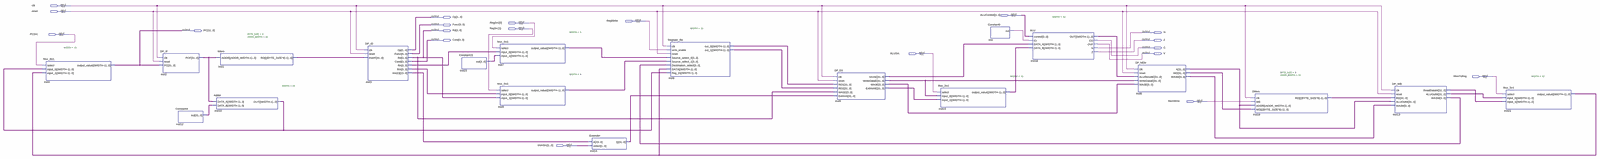
[diagram p0: schematic sheet, whole]
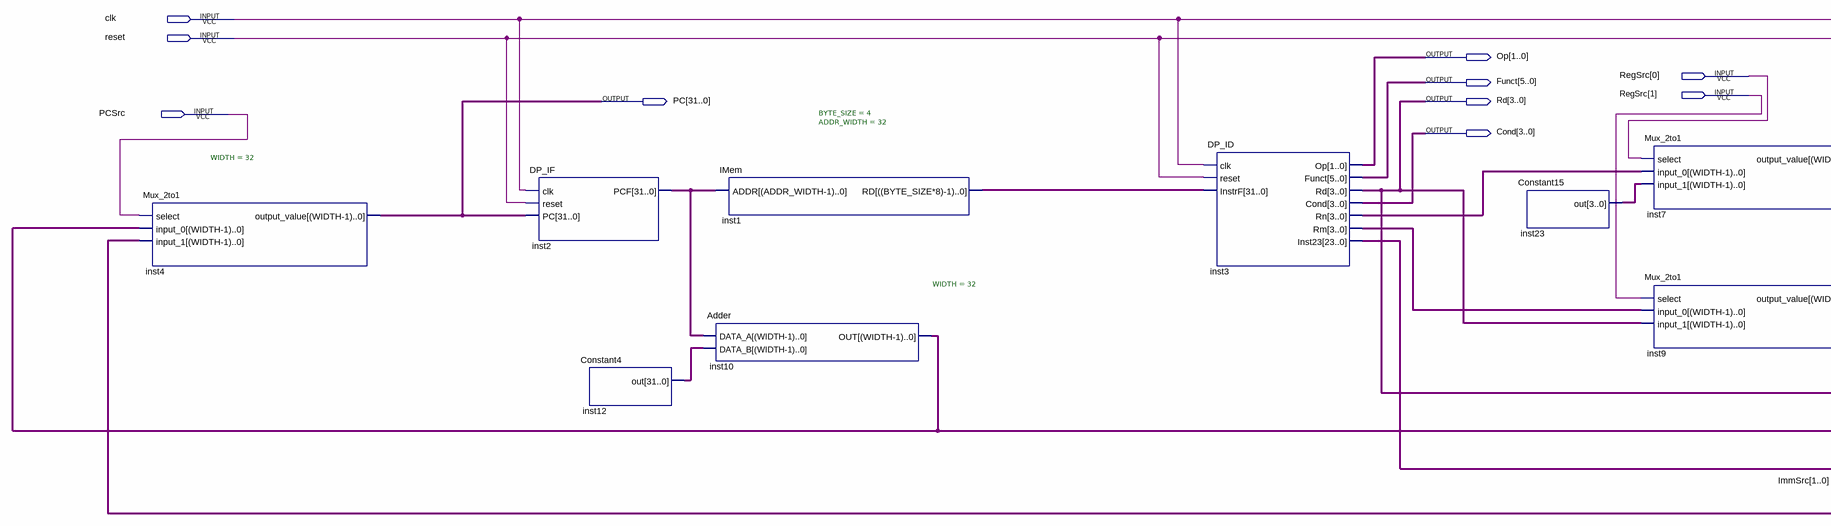
[diagram p1: schematic sheet, left part]
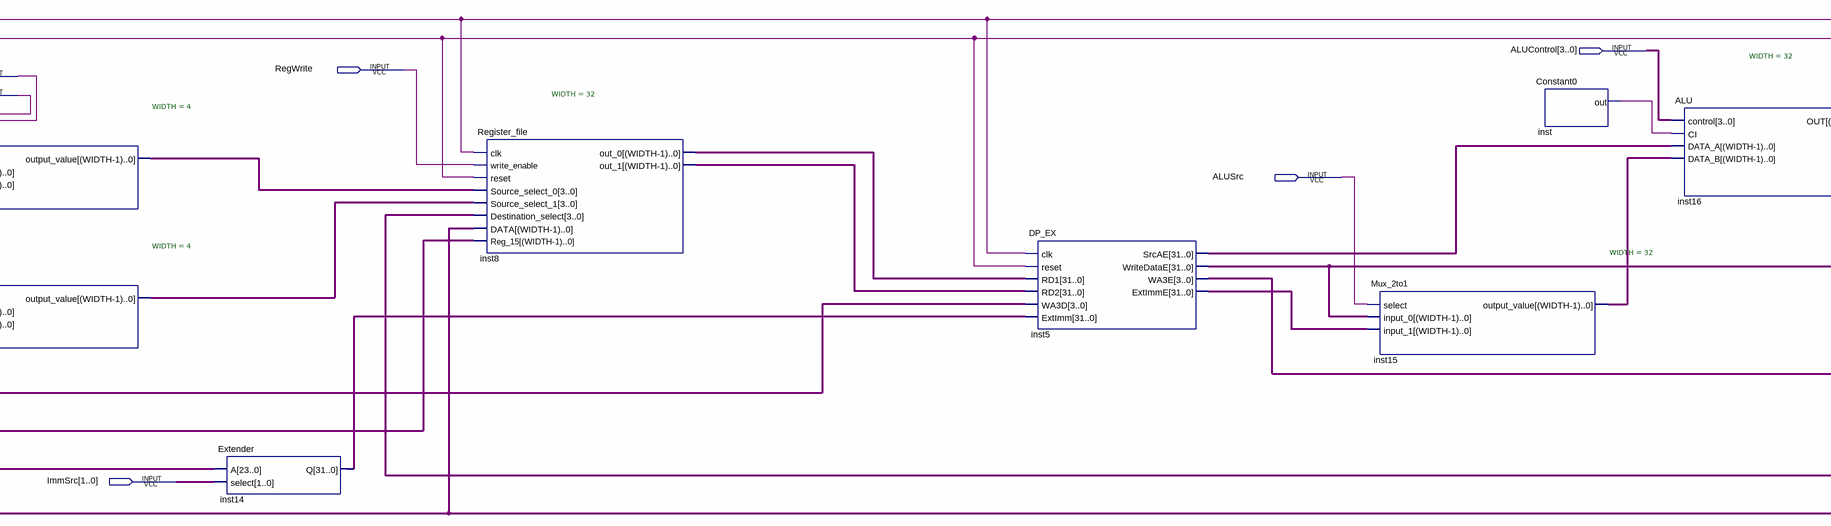
[diagram p2: schematic sheet, centre part]
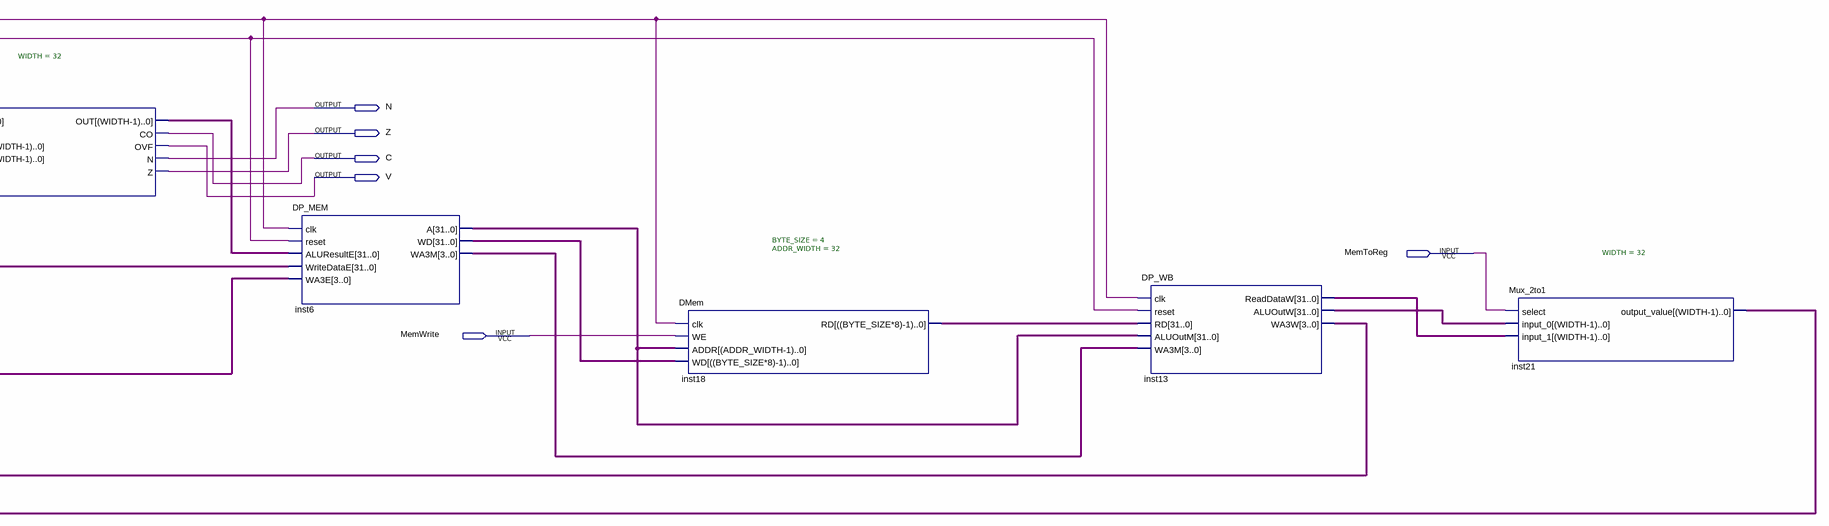
[diagram p3: schematic sheet, right part]
// Quartus schematic Datapath.bdf as structural Verilog: 19 symbols, 20 pins
module Datapath (
  input  clk,
  input  reset,
  input  [3:0] ALUControl,
  input  RegWrite,
  input  [1:0] RegSrc,
  input  PCSrc,
  input  ALUSrc,
  input  MemToReg,
  input  MemWrite,
  input  [1:0] ImmSrc,
  output [1:0] Op,
  output [5:0] Funct,
  output [31:0] PC,
  output [3:0] Rd,
  output N,
  output [3:0] Cond,
  output Z,
  output C,
  output V
);

  wire inst_out;
  wire [3:0] inst3_rm, inst3_rn, inst5_wa3e, inst6_wa3m, inst7_output_value, inst9_output_value, inst13_wa3w,
       inst23_out;
  wire [23:0] inst3_inst23;
  wire [31:0] inst1_rd, inst2_pcf, inst5_extimme, inst5_srcae, inst5_writedatae, inst6_a, inst6_wd,
       inst8_out_0, inst8_out_1, inst10_out, inst12_out, inst13_aluoutw, inst13_readdataw, inst14_q,
       inst15_output_value, inst16_out, inst18_rd, inst21_output_value;

  Mux_2to1 #(.WIDTH(32)) inst4 (.select(PCSrc), .input_0(inst10_out), .input_1(inst21_output_value), .output_value(PC));
  DP_IF inst2 (.clk(clk), .reset(reset), .PC(PC), .PCF(inst2_pcf));
  Constant4 inst12 (.out(inst12_out));
  IMem #(.BYTE_SIZE(4), .ADDR_WIDTH(32)) inst1 (.ADDR(inst2_pcf), .RD(inst1_rd));
  Adder #(.WIDTH(32)) inst10 (.DATA_A(inst2_pcf), .DATA_B(inst12_out), .OUT(inst10_out));
  DP_ID inst3 (
    .clk(clk), .reset(reset), .InstrF(inst1_rd), .Op(Op), .Funct(Funct), .Rd(Rd), .Cond(Cond), .Rn(inst3_rn),
    .Rm(inst3_rm), .Inst23(inst3_inst23));
  Constant15 inst23 (.out(inst23_out));
  Mux_2to1 #(.WIDTH(4)) inst7 (
    .select(RegSrc[0]), .input_0(inst3_rn), .input_1(inst23_out), .output_value(inst7_output_value));
  Mux_2to1 #(.WIDTH(4)) inst9 (.select(RegSrc[1]), .input_0(inst3_rm), .input_1(Rd), .output_value(inst9_output_value));
  Extender inst14 (.A(inst3_inst23), .select(ImmSrc), .Q(inst14_q));
  Register_file #(.WIDTH(32)) inst8 (
    .clk(clk), .write_enable(RegWrite), .reset(reset), .Source_select_0(inst7_output_value),
    .Source_select_1(inst9_output_value), .Destination_select(inst13_wa3w), .DATA(inst21_output_value),
    .Reg_15(inst10_out), .out_0(inst8_out_0), .out_1(inst8_out_1));
  DP_EX inst5 (
    .clk(clk), .reset(reset), .RD1(inst8_out_0), .RD2(inst8_out_1), .WA3D(Rd), .ExtImm(inst14_q),
    .SrcAE(inst5_srcae), .WriteDataE(inst5_writedatae), .WA3E(inst5_wa3e), .ExtImmE(inst5_extimme));
  Mux_2to1 #(.WIDTH(32)) inst15 (
    .select(ALUSrc), .input_0(inst5_writedatae), .input_1(inst5_extimme), .output_value(inst15_output_value));
  Constant0 inst (.out(inst_out));
  ALU #(.WIDTH(32)) inst16 (
    .control(ALUControl), .CI(inst_out), .DATA_A(inst5_srcae), .DATA_B(inst15_output_value),
    .OUT(inst16_out), .CO(C), .OVF(V), .N(N), .Z(Z));
  DP_MEM inst6 (
    .clk(clk), .reset(reset), .ALUResultE(inst16_out), .WriteDataE(inst5_writedatae), .WA3E(inst5_wa3e),
    .A(inst6_a), .WD(inst6_wd), .WA3M(inst6_wa3m));
  DMem #(.BYTE_SIZE(4), .ADDR_WIDTH(32)) inst18 (
    .clk(clk), .WE(MemWrite), .ADDR(inst6_a), .WD(inst6_wd), .RD(inst18_rd));
  DP_WB inst13 (
    .clk(clk), .reset(reset), .RD(inst18_rd), .ALUOutM(inst6_a), .WA3M(inst6_wa3m),
    .ReadDataW(inst13_readdataw), .ALUOutW(inst13_aluoutw), .WA3W(inst13_wa3w));
  Mux_2to1 #(.WIDTH(32)) inst21 (
    .select(MemToReg), .input_0(inst13_aluoutw), .input_1(inst13_readdataw),
    .output_value(inst21_output_value));
endmodule
